# Altium schematic sheet Power.SchDoc
size B; DocumentNumber: 2; SheetNumber: 2; SheetTotal: 9
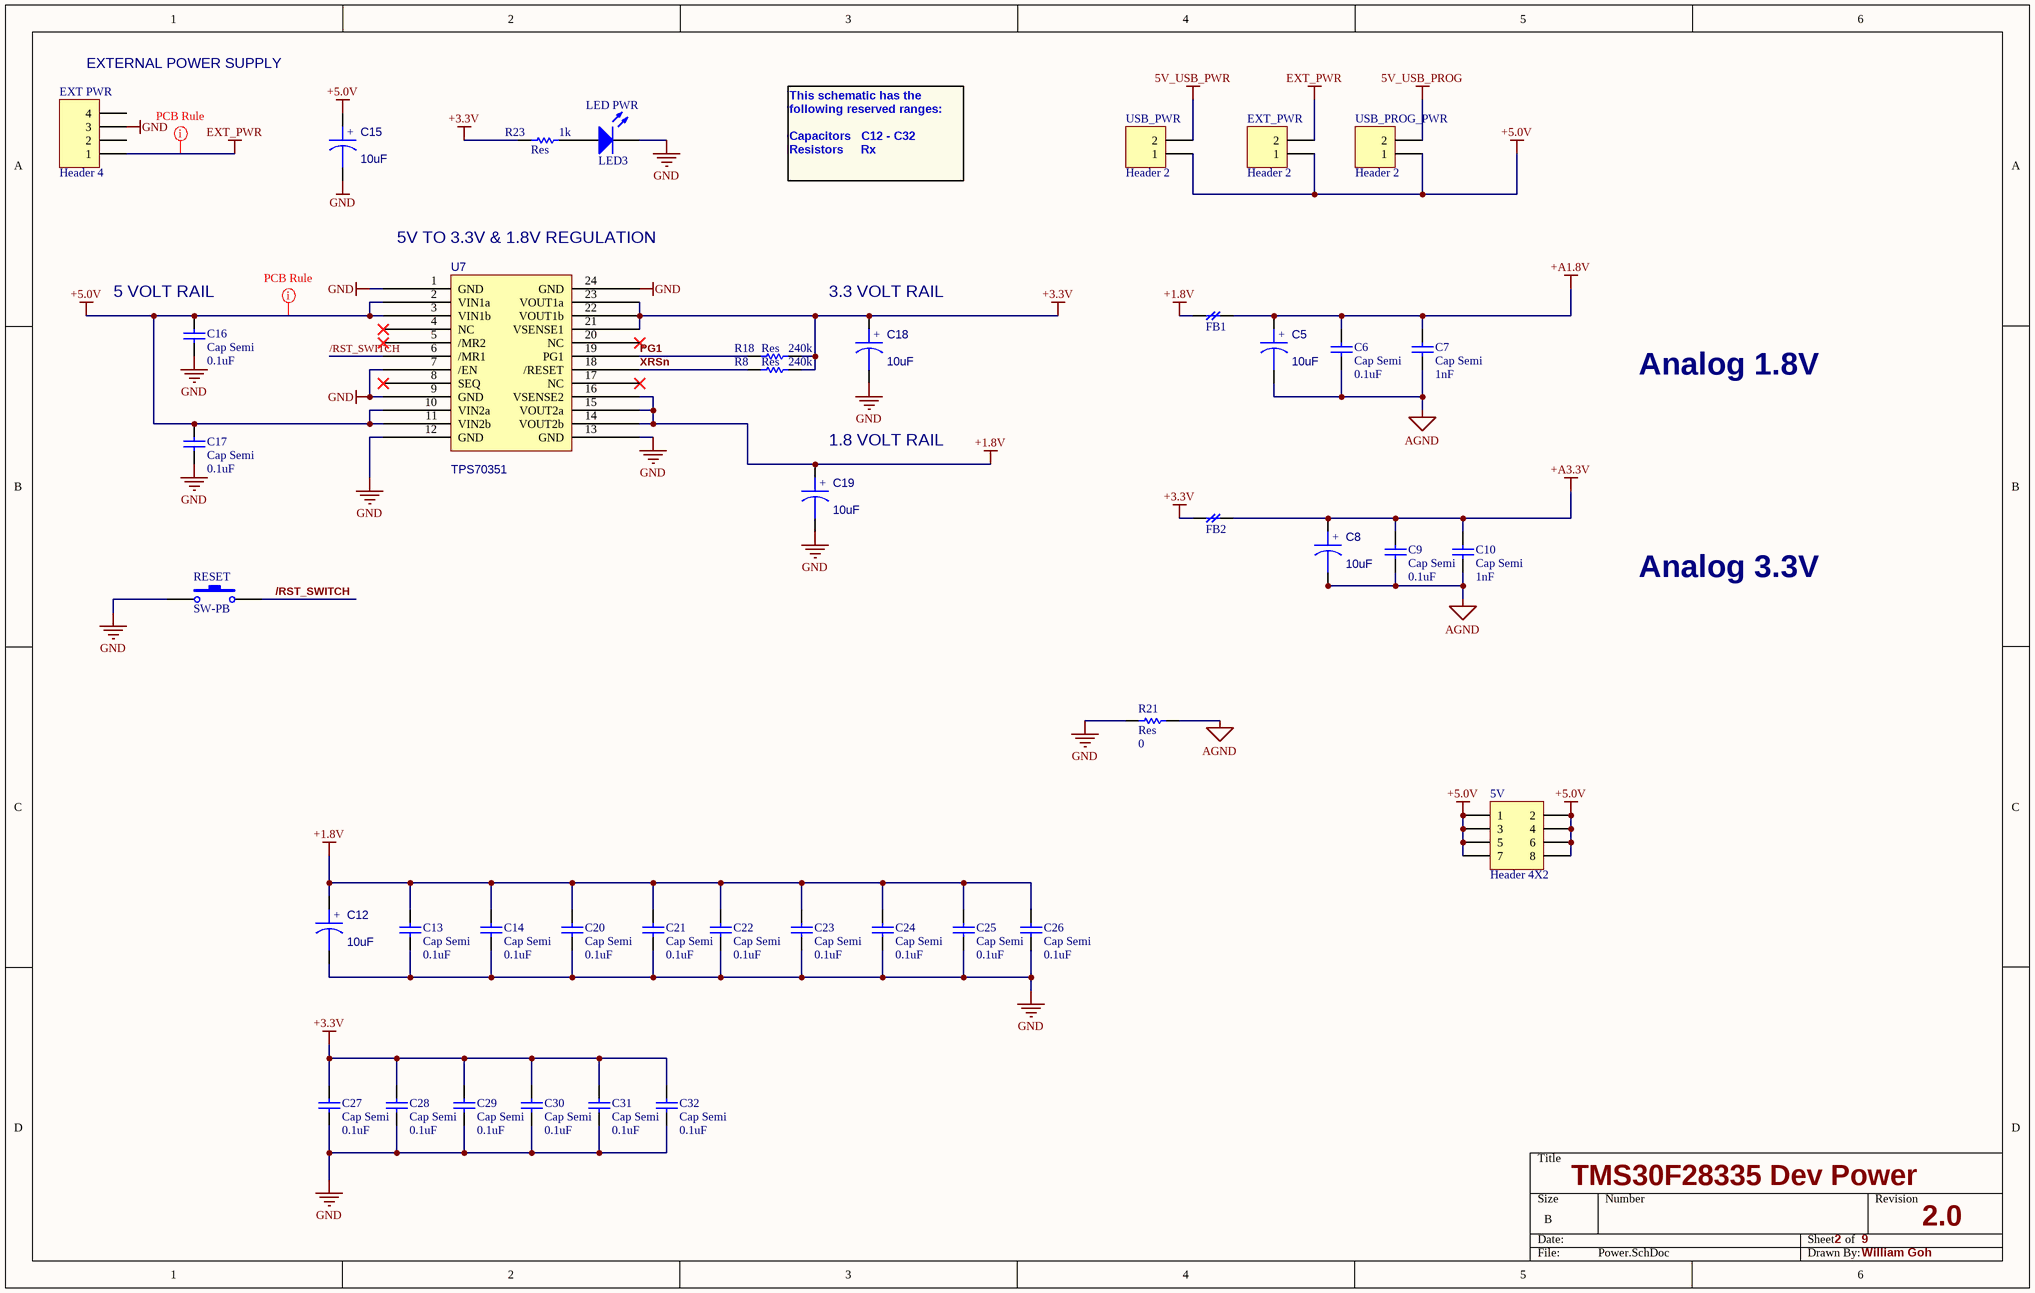
[diagram p0: Power.SchDoc]

## Parts
5V  Header 4X2  [HDR2X4]
C5  10uF  [3528]
C6  Cap Semi  value 0.1uF  [0805]
C7  Cap Semi  value 1nF  [0805]
C8  10uF  [3528]
C9  Cap Semi  value 0.1uF  [0805]
C10  Cap Semi  value 1nF  [0805]
C12  10uF  [3528]
C13  Cap Semi  value 0.1uF  [0805]
C14  Cap Semi  value 0.1uF  [0805]
C15  10uF  [3528]
C16  Cap Semi  value 0.1uF  [0805]
C17  Cap Semi  value 0.1uF  [0805]
C18  10uF  [3528]
C19  10uF  [3528]
C20  Cap Semi  value 0.1uF  [0805]
C21  Cap Semi  value 0.1uF  [0805]
C22  Cap Semi  value 0.1uF  [0805]
C23  Cap Semi  value 0.1uF  [0805]
C24  Cap Semi  value 0.1uF  [0805]
C25  Cap Semi  value 0.1uF  [0805]
C26  Cap Semi  value 0.1uF  [0805]
C27  Cap Semi  value 0.1uF  [0805]
C28  Cap Semi  value 0.1uF  [0805]
C29  Cap Semi  value 0.1uF  [0805]
C30  Cap Semi  value 0.1uF  [0805]
C31  Cap Semi  value 0.1uF  [0805]
C32  Cap Semi  value 0.1uF  [0805]
EXT_PWR  Header 4  [HDR1X4]
EXT_PWR  Header 2  [HDR1X2]
FB1  Ferrite_Bead  [CR2012-0805]  (value not drawn)
FB2  Ferrite_Bead  [CR2012-0805]  (value not drawn)
LED_PWR  LED3  [0805]
R8  Res  value 240k  [0805]
R18  Res  value 240k  [0805]
R21  Res  value 0  [0805]
R23  Res  value 1k  [0805]
RESET  SW-PB  [SWITCH_2PAD_SMD]
U7  TPS70351  [PWP24]
USB_PROG_PWR  Header 2  [HDR1X2]
USB_PWR  Header 2  [HDR1X2]

## Nets
5V_USB_PROG: USB_PROG_PWR.2
5V_USB_PWR: USB_PWR.2
+1.8V: C12.1 C13.2 C14.2 C19.1 C20.2 C21.2 C22.2 C23.2 C24.2 C25.2 C26.2 FB1.1 U7.14(VOUT2b) U7.15(VOUT2a) U7.16(VSENSE2)
+3.3V: C18.1 C27.2 C28.2 C29.2 C30.2 C31.2 C32.2 FB2.1 R8.2 R18.2 R23.1 U7.21(VSENSE1) U7.22(VOUT1b) U7.23(VOUT1a)
+5.0V: 5V.1 5V.2 5V.3 5V.4 5V.5 5V.6 5V.7 5V.8 C15.1 C16.2 C17.2 EXT_PWR.1 U7.2(VIN1a) U7.3(VIN1b) U7.10(VIN2a) U7.11(VIN2b) USB_PROG_PWR.1 USB_PWR.1
+A1.8V: C5.1 C6.2 C7.2 FB1.2
+A3.3V: C8.1 C9.2 C10.2 FB2.2
AGND: C5.2 C6.1 C7.1 C8.2 C9.1 C10.1 R21.2
EXT_PWR: EXT_PWR.1 EXT_PWR.2
GND: C12.2 C13.1 C14.1 C15.2 C16.1 C17.1 C18.2 C19.2 C20.1 C21.1 C22.1 C23.1 C24.1 C25.1 C26.1 C27.1 C28.1 C29.1 C30.1 C31.1 C32.1 EXT_PWR.3 LED_PWR.2(K) R21.1 RESET.1 U7.1(GND) U7.7(/EN) U7.9(GND) U7.12(GND) U7.13(GND) U7.24(GND)
/RST_SWITCH: RESET.2 U7.6(/MR1)
PG1: R18.1 U7.19(PG1)
XRSn: R8.1 U7.18(/RESET)
NetLED_PWR_1: LED_PWR.1(A) R23.2

Not connected (* = marked no-connect by the designer): EXT_PWR 2 4; U7 4(NC)* 5(/MR2)* 8(SEQ)* 17(NC)* 20(NC)*

## Layout directives
rule Width Constraint [Pref Width = 15mil    Min Width = 15mil    Max Width = 15mil]: EXT_PWR
rule Width Constraint [Pref Width = 11mil    Min Width = 11mil    Max Width = 15mil]: +5.0V

## Notes on the sheet
- (near EXT_PWR) EXTERNAL POWER SUPPLY
- This schematic has the following reserved ranges:
  Capacitors   C12 - C32
  Resistors     Rx
- (near C16) 5 VOLT RAIL
- (near U7) 5V TO 3.3V & 1.8V REGULATION
- (near C18) 3.3 VOLT RAIL
- Analog 1.8V
- (near C19) 1.8 VOLT RAIL
- Analog 3.3V
- TMS30F28335 Dev Power
- 2.0
- William Goh
- (in symbol CAPACITOR POL) +

## Library data of the parts
5V = Header 4X2: Header, 4-Pin, Dual row; LatestRevisionDate: 17-Jul-2002; LatestRevisionNote: Re-released for DXP Platform.; Publisher: Altium Limited
C5 C8 C18 = CAPACITOR POL: digi-399-3096-1-ND
C6 C7 C9 C10 C13 C14 C16 C17 C20-C32 = Cap Semi: Capacitor (Semiconductor SIM Model); Published: 8-Jun-2000; LatestRevisionDate: 17-Jul-2002; LatestRevisionNote: Re-released for DXP Platform.; PackageReference: C1206; Publisher: Altium Limited
C12 C19 = CAPACITOR POL: digi-399-1576-1-ND
C15 = CAPACITOR POL: digi-399-1563-1-ND
EXT_PWR = Header 4: Header, 4-Pin; LatestRevisionDate: 17-Jul-2002; LatestRevisionNote: Re-released for DXP Platform.; Publisher: Altium Limited
EXT_PWR USB_PROG_PWR USB_PWR = Header 2: Header, 2-Pin; LatestRevisionDate: 17-Jul-2002; LatestRevisionNote: Re-released for DXP Platform.; Publisher: Altium Limited
FB1 FB2 = Ferrite_Bead: Ferrite Bead; Digikey #: 445-1554-1-ND
LED_PWR = LED3: Typical BLUE SiC LED; Published: 8-Jun-2000; LatestRevisionDate: 17-Dec-2003; LatestRevisionNote: PCB Footprint replaced.; DatasheetDocument: 16-Apr-2002; PackageDocument: 16-Apr-2002; PackageReference: 3.5X2.8X1.9; Publisher: Altium Limited
R8 R18 R21 R23 = Res Semi: Semiconductor Resistor; Published: 8-Jun-2000; LatestRevisionDate: 17-Jul-2002; LatestRevisionNote: Re-released for DXP Platform.; PackageReference: AXIAL-0.5; Publisher: Altium Limited
RESET = SW-PB: Switch; Published: 24-Mar-1999; LatestRevisionDate: 17-Jul-2002; LatestRevisionNote: Re-released for DXP Platform.; PackageReference: SPST-2; Publisher: Altium Limited; Digikey #: CKN9119CT-ND
U7 = TPS70351: IC 3.3V/1.8V LDO REG 24-HTSSOP; Digikey #: 296-8024-5-ND